# EAGLE design WattMeter (EAGLE 6.3)
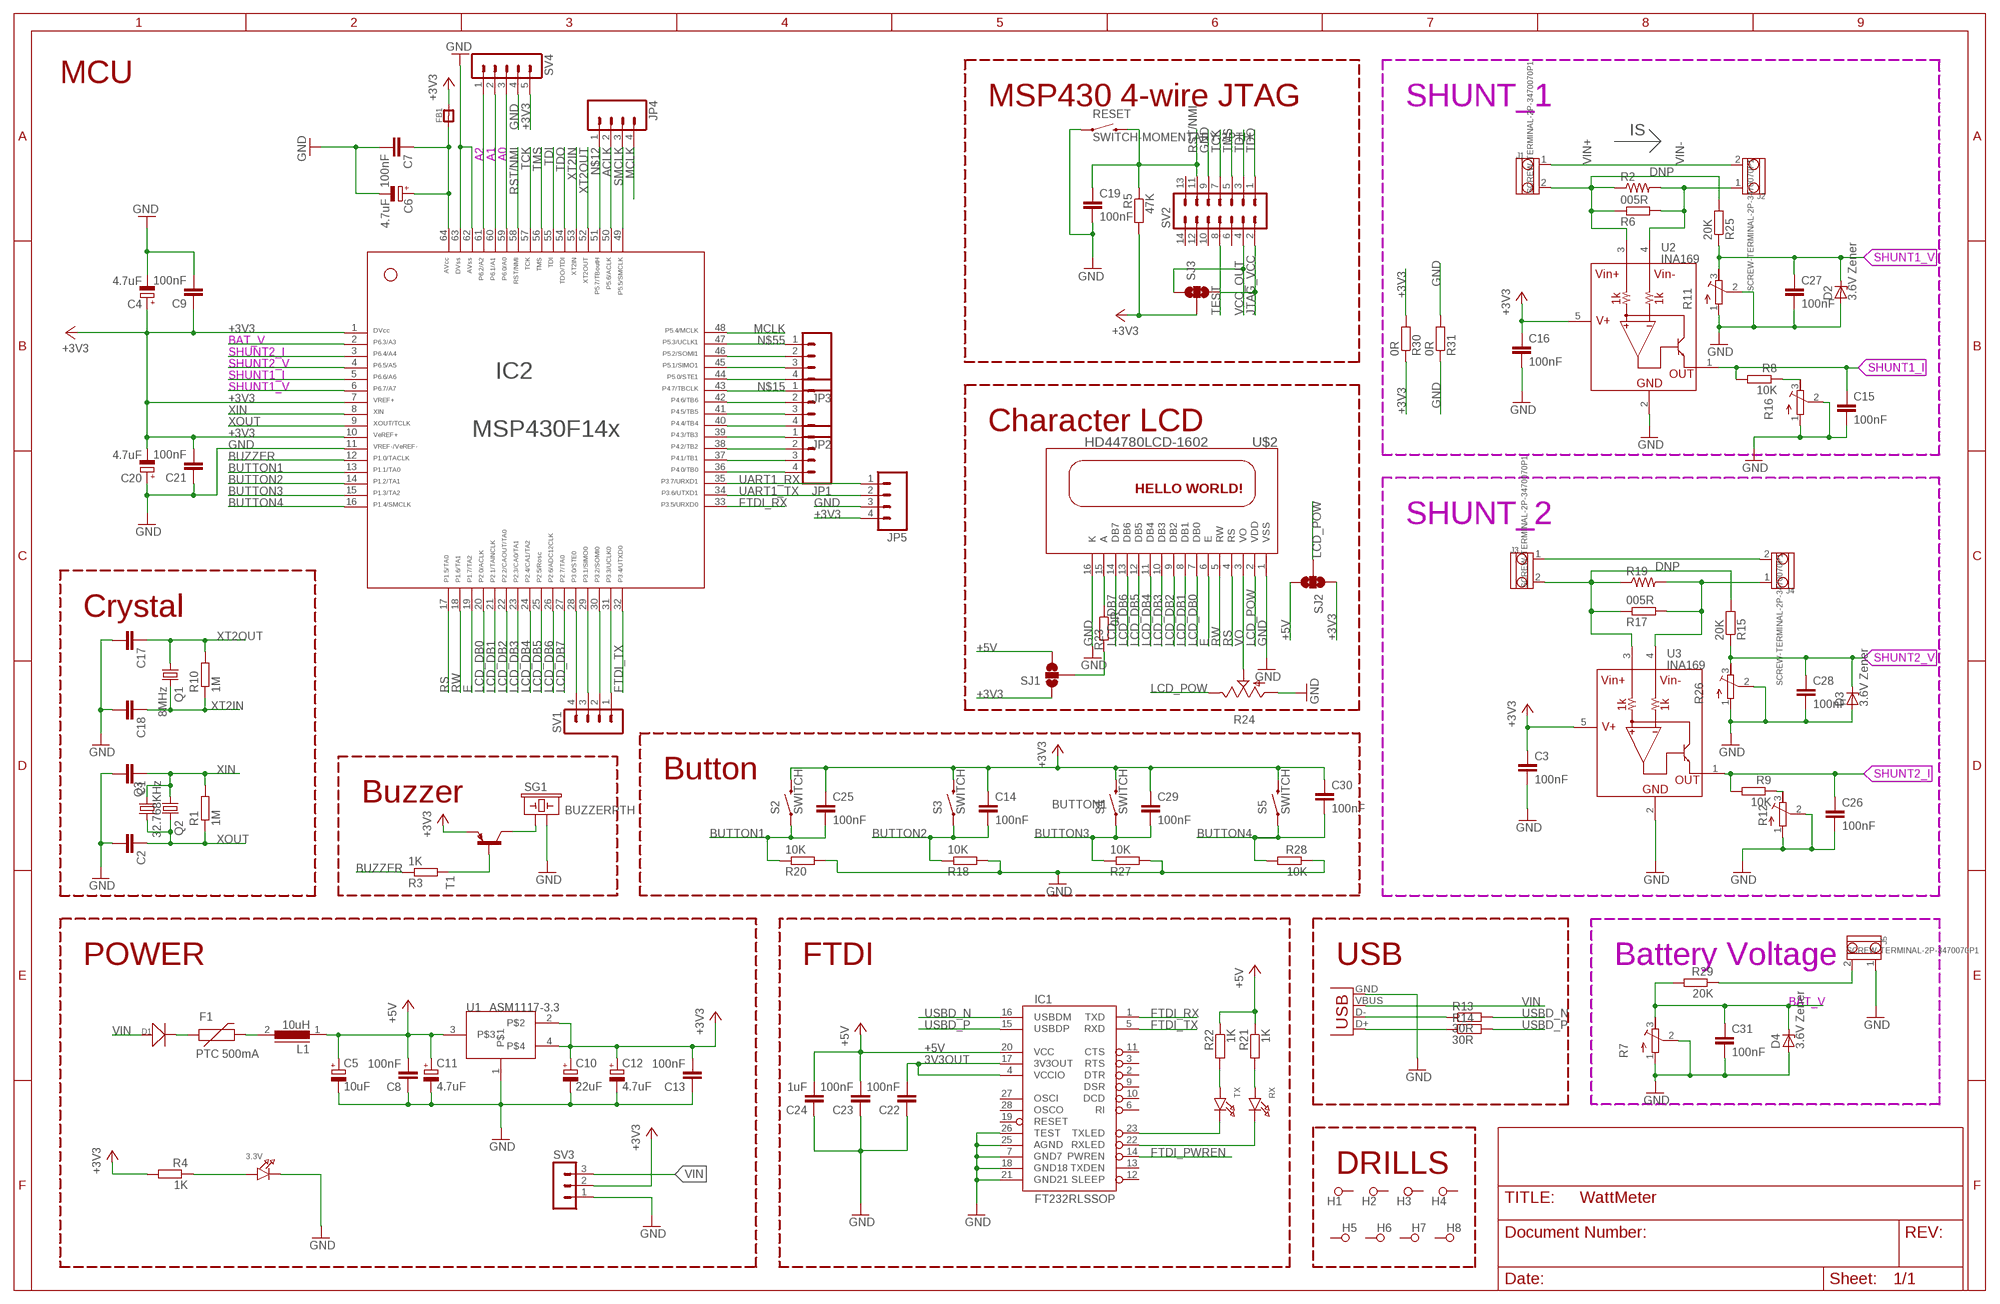
[diagram p0: schematic, sheet 1]

## Parts
3.3V  LED0805  [CHIPLED_0805]
C1  C-EUC0805  [C0805]
C2  C-EUC0805  [C0805]
C3  100nF  C-EUC0805  [C0805]
C4  4.7uF  CPOL-EUA/3216-18W  [A/3216-18W]
C5  10uF  CPOL-EU150CLZ-0810  [150CLZ-0810]
C6  4.7uF  CPOL-EUA/3216-18W  [A/3216-18W]
C7  100nF  C-EUC0805  [C0805]
C8  100nF  C-EUC0805  [C0805]
C9  100nF  C-EUC0805  [C0805]
C10  22uF  CPOL-EUB/3528-21R  [B/3528-21R]
C11  4.7uF  CPOL-EUA/3216-18W  [A/3216-18W]
C12  4.7uF  CPOL-EUA/3216-18W  [A/3216-18W]
C13  100nF  C-EUC0805  [C0805]
C14  100nF  C-EUC0805  [C0805]
C15  100nF  C-EUC0805  [C0805]
C16  100nF  C-EUC0805  [C0805]
C17  C-EUC0805  [C0805]
C18  C-EUC0805  [C0805]
C19  100nF  C-EUC0805  [C0805]
C20  4.7uF  CPOL-EUA/3216-18W  [A/3216-18W]
C21  100nF  C-EUC0805  [C0805]
C22  100nF  C-EUC0805  [C0805]
C23  100nF  C-EUC0805  [C0805]
C24  1uF  C-EUC0805  [C0805]
C25  100nF  C-EUC0805  [C0805]
C26  100nF  C-EUC0805  [C0805]
C27  100nF  C-EUC0805  [C0805]
C28  100nF  C-EUC0805  [C0805]
C29  100nF  C-EUC0805  [C0805]
C30  100nF  C-EUC0805  [C0805]
C31  100nF  C-EUC0805  [C0805]
D1  D-D1206  [LL-34]
D2  3.6V Zener  ZENER-DIODESMB  [SMB]
D3  3.6V Zener  ZENER-DIODESMB  [SMB]
D4  3.6V Zener  ZENER-DIODESMB  [SMB]
F1  PTC 500mA  PTCSMD  [PTC-1206]
FB1  FERRITE0805  [0805]
H1  SPECIAL_DRILL_0.1000  [PAD_0.1000]
H2  SPECIAL_DRILL_0.1000  [PAD_0.1000]
H3  SPECIAL_DRILL_0.1000  [PAD_0.1000]
H4  SPECIAL_DRILL_0.1000  [PAD_0.1000]
H5  SPECIAL_DRILL_0.1000  [PAD_0.1000]
H6  SPECIAL_DRILL_0.1000  [PAD_0.1000]
H7  SPECIAL_DRILL_0.1000  [PAD_0.1000]
H8  SPECIAL_DRILL_0.1000  [PAD_0.1000]
IC1  FT232RLSSOP  [SSOP28DB]
IC2  F14X---PM/PAG64  [PM/PAG64]
J1  SCREW-TERMINAL-2P-3470070P1  [2P-3.5]
J2  SCREW-TERMINAL-2P-3470070P1  [2P-3.5]
J3  SCREW-TERMINAL-2P-3470070P1  [2P-3.5]
J4  SCREW-TERMINAL-2P-3470070P1  [2P-3.5]
J5  SCREW-TERMINAL-2P-3470070P1  [2P-3.5]
JP1  M041.27MM  [1X04-1.27MM]
JP2  M041.27MM  [1X04-1.27MM]
JP3  M041.27MM  [1X04-1.27MM]
JP4  M041.27MM  [1X04-1.27MM]
JP5  M041.27MM  [1X04-1.27MM]
L1  10uH  DR74  [DR74]
Q1  8MHz  CRYSTALHC49U-V  [HC49U-V]
Q2  32.768KHz  CRYSTALHC49U-V  [HC49U-V]
Q3  CRYSTALTC38H  [TC38H]
R1  1M  R-EU_R0805  [R0805]
R2  RESISTORPTH-2W  [AXIAL-0.8]
R3  1K  R-EU_R0805  [R0805]
R4  1K  R-EU_R0805  [R0805]
R5  47K  R-EU_R0805  [R0805]
R6  005R  R-EU_R2512  [R2512]
R7  R-TRIMM3296W  [RTRIM3296W]
R8  10K  R-EU_R0805  [R0805]
R9  10K  R-EU_R0805  [R0805]
R10  1M  R-EU_R0805  [R0805]
R11  R-TRIMM3296W  [RTRIM3296W]
R12  R-TRIMM3296W  [RTRIM3296W]
R13  30R  R-EU_R0805  [R0805]
R14  30R  R-EU_R0805  [R0805]
R15  20K  R-EU_R0805  [R0805]
R16  R-TRIMM3296W  [RTRIM3296W]
R17  005R  R-EU_R2512  [R2512]
R18  10K  R-EU_R0805  [R0805]
R19  RESISTORPTH-2W  [AXIAL-0.8]
R20  10K  R-EU_R0805  [R0805]
R21  1K  R-EU_R0805  [R0805]
R22  1K  R-EU_R0805  [R0805]
R23  0R  R-EU_R0805  [R0805]
R24  TRIM_US-3223G  [3223G]
R25  20K  R-EU_R0805  [R0805]
R26  R-TRIMM3296W  [RTRIM3296W]
R27  10K  R-EU_R0805  [R0805]
R28  10K  R-EU_R0805  [R0805]
R29  20K  R-EU_R0805  [R0805]
R30  0R  R-EU_R1206  [R1206]
R31  0R  R-EU_R1206  [R1206]
RESET  SWITCH-MOMENTARY-2PTH  [TACTILE-PTH]
RX  LED0805  [CHIPLED_0805]
S2  SWITCH  SWITCH-MOMENTARY-2PTH  [TACTILE-PTH]
S3  SWITCH  SWITCH-MOMENTARY-2PTH  [TACTILE-PTH]
S4  SWITCH  SWITCH-MOMENTARY-2PTH  [TACTILE-PTH]
S5  SWITCH  SWITCH-MOMENTARY-2PTH  [TACTILE-PTH]
SG1  BUZZERPTH  [BUZZER-12MM]
SJ1  SOLDERJUMPER_2WAYS  [SJ_3]
SJ2  SOLDERJUMPER_2WAYS  [SJ_3]
SJ3  SOLDERJUMPER_2WAYS  [SJ_3]
SV1  MA04-1  [MA04-1]
SV2  ML14L  [ML14L]
SV3  MA03-1  [MA03-1]
SV4  MA05-1  [MA05-1]
T1  MMBT3906LT1-PNP-SOT23-BEC  [SOT23-BEC]
TX  LED0805  [CHIPLED_0805]
U1  ASM1117-3.3  [SOT223]
U2  INA169  [SOT23-5]
U3  INA169  [SOT23-5]
U$2  HD44780LCD-1602  [LCD1602]
X2  USBPTH  [USB-B-PTH]

## Nets
3V3OUT: C22.2 IC1.4(VCCIO) IC1.17(3V3OUT)
+3V3: C3.1 C4.+ C9.1 C10.+ C12.+ C13.2 C14.1 C16.1 C20.- C21.2 C25.1 C29.1 C30.1 FB1.1 IC2.1 IC2.7 IC2.10 JP5.4 R4.2 R5.2 R30.1 R30.2 S2.3 S3.3 S4.3 S5.3 SJ1.1 SJ2.1 SJ3.2 SV3.2 SV4.5 T1.E U1.2 U1.4 U2.5(V+) U3.5(V+)
+5V: C5.+ C8.2 C11.+ C23.2 C24.2 IC1.20(VCC) L1.1 R21.1 R22.1 SJ1.3 SJ2.3 U1.3
A0: IC2.59 SV4.3
A1: IC2.60 SV4.2
A2: IC2.61 SV4.1
ACLK: IC2.50 JP4.2
BAT_V: C31.1 D4.C IC2.2 R7.3(E) R29.2
BUTTON1: C25.2 IC2.13 R20.1 S2.1
BUTTON2: C14.2 IC2.14 R18.1 S3.1
BUTTON3: C29.2 IC2.15 R27.1 S4.1
BUTTON4: C30.2 IC2.16 R28.2 S5.1
BUZZER: IC2.12 R3.1
E: IC2.19 U$2.6(E)
FTDI_PWREN: IC1.14(PWREN)
FTDI_RX: IC1.1(TXD) IC2.33
FTDI_TX: IC1.5(RXD) IC2.32
GND: 3.3V.C C1.2 C2.2 C3.2 C4.- C5.- C6.- C7.2 C8.1 C9.2 C10.- C11.- C12.- C13.1 C15.2 C16.2 C17.2 C18.2 C19.2 C20.+ C21.1 C22.1 C23.1 C24.1 C26.2 C27.2 C28.2 C31.2 D2.A D3.A D4.A IC1.7(GND7) IC1.18(GND18) IC1.21(GND21) IC1.25(AGND) IC1.26(TEST) IC2.11 IC2.62 IC2.63 J5.1 JP5.3 R7.1(A) R7.2(S) R11.1(A) R11.2(S) R12.1(A) R12.2(S) R16.1(A) R16.2(S) R18.2 R20.2 R24.1(A) R26.1(A) R26.2(S) R27.2 R28.1 R31.1 R31.2 RESET.1 SG1.- SV2.9 SV3.1 SV4.4 U1.1 U2.2(GND) U3.2(GND) U$2.1(VSS) U$2.16(K) X2.GND
JTAG_VCC: SJ3.3 SV2.2
LCD_DB0: IC2.20 U$2.7(DB0)
LCD_DB1: IC2.21 U$2.8(DB1)
LCD_DB2: IC2.22 U$2.9(DB2)
LCD_DB3: IC2.23 U$2.10(DB3)
LCD_DB4: IC2.24 U$2.11(DB4)
LCD_DB5: IC2.25 U$2.12(DB5)
LCD_DB6: IC2.26 U$2.13(DB6)
LCD_DB7: IC2.27 U$2.14(DB7)
LCD_POW: R24.3(E) SJ2.2 U$2.2(VDD)
MCLK: IC2.48 JP4.4
N$1: SG1.+ T1.C
N$2: D1.C(-) F1.1
N$3: C6.+ C7.1 FB1.2 IC2.64
N$4: IC2.29 SV1.3
N$5: F1.2 L1.2
N$6: IC2.38 JP1.2
N$7: 3.3V.A R4.1
N$8: IC2.37 JP1.3
N$9: IC2.28 SV1.4
N$10: R8.1 R16.3(E)
N$11: J1.1 J2.2
N$12: IC2.51 JP4.1
N$13: J5.2 R29.1
N$14: R3.2 T1.B
N$15: IC2.43 JP2.1
N$16: IC2.36 JP1.4
N$17: R9.1 R12.3(E)
N$18: J3.1 J4.2
N$19: R23.2 SJ1.2
N$21: R23.1 U$2.15(A)
N$30: R22.2 TX.A
N$34: IC1.23(TXLED) TX.C
N$38: R21.2 RX.A
N$39: IC2.46 JP3.2
N$41: IC2.44 JP3.4
N$42: IC1.22(RXLED) RX.C
N$43: IC2.42 JP2.2
N$44: IC2.40 JP2.4
N$51: IC2.39 JP1.1
N$52: IC2.41 JP2.3
N$54: IC2.45 JP3.3
N$55: IC2.47 JP3.1
N$56: IC2.30 SV1.2
N$57: IC2.31 SV1.1
N$60_N: R13.1 X2.D-
N$60_P: R14.1 X2.D+
N$62: J4.1 R17.2 R19.P$2 U3.4(VIN-)
N$63: J3.2 R15.2 R17.1 R19.P$1 U3.3(VIN+)
RS: IC2.17 U$2.4(RS)
RST/NMI: C19.1 IC2.58 R5.1 RESET.3 SV2.11
RW: IC2.18 U$2.5(RW)
SHUNT1_I: C15.1 IC2.5 R8.2 U2.1(OUT)
SHUNT1_V: C27.1 D2.C IC2.6 R11.3(E) R25.1
SHUNT2_I: C26.1 IC2.3 R9.2 U3.1(OUT)
SHUNT2_V: C28.1 D3.C IC2.4 R15.1 R26.3(E)
SMCLK: IC2.49 JP4.3
TCK: IC2.57 SV2.7
TDI: IC2.55 SV2.3
TDO: IC2.54 SV2.1
TEST: SV2.8
TMS: IC2.56 SV2.5
UART1_RX: IC2.35 JP5.1
UART1_TX: IC2.34 JP5.2
USBD_N: IC1.16(USBDM) R13.2
USBD_P: IC1.15(USBDP) R14.2
VCC_OUT: SJ3.1 SV2.4
VIN: D1.A(+) SV3.3 X2.VBUS
VIN+: J1.2 R2.P$1 R6.1 R25.2 U2.3(VIN+)
VIN-: J2.1 R2.P$2 R6.2 U2.4(VIN-)
VO: R24.2(S) U$2.3(VO)
XIN: C1.1 IC2.8 Q2.1 Q3.2 R1.2
XOUT: C2.1 IC2.9 Q2.2 Q3.1 R1.1
XT2IN: C18.1 IC2.53 Q1.2 R10.1
XT2OUT: C17.1 IC2.52 Q1.1 R10.2
Unconnected: H1.1 H2.1 H3.1 H4.1 H5.1 H6.1 H7.1 H8.1 IC1.2(DTR) IC1.3(RTS) IC1.6(RI) IC1.9(DSR) IC1.10(DCD) IC1.11(CTS) IC1.12(SLEEP) IC1.13(TXDEN) IC1.19(RESET) IC1.27(OSCI) IC1.28(OSCO) SV2.6 SV2.10 SV2.12 SV2.13 SV2.14

## Notes on the sheet
- MCU
- MSP430 4-wire JTAG | SHUNT_1
- IS
- Character LCD
- SHUNT_2
- Crystal
- Button
- Buzzer
- POWER | FTDI | USB | Battery Voltage
- DRILLS

## Library data of the parts
3.3V RX TX = microbuilder:LED: LED 0603 - 0603 Surface Mount Package 2mA: Green LED - Low Power (3.9mcd, 2ma, 1.7Vf) - Digikey: 475-2709-2-ND Orange LED - Low Power (9.8mcd, 2ma, 1.8Vf) - Digikey: 475-1194-2-ND Red LED - Low Power (5mcd, 2ma, 1.8Vf) - Digikey: 475-1195-2-ND Yellow LED - Low Power (7mcd, 2ma, 1.8Vf) - Digikey: 475-1196-2-ND 5mA: Blue LED - Low Power (17mcd, 5ma, 2.9Vf) - Digikey: LNJ937W8CRACT-ND 0805 - 0805 Surface Mount Package 2mA: Red LED (8.8mcd, 2mA, 1.8Vf, Clear) - Low Power [Digikey: 475-2510-1-ND] Green LED (5mcd, 2mA, 1.8Vf, Clear) - Low Power [Digikey: 475-2730-1-ND] Yellow LED (11.3mcd, 2mA, 1.8Vf, Clear) - Low Power [Digikey: 475-2555-1-ND] 20mA: Red LED (104mcd, 20mA, Diffused) - LS R976 [Digikey: 475-1278-6-ND] Red LED (12mcd, 20mA, 2.0Vf, Clear) - APT2012EC [Digikey: 754-1128-1-ND] Green LED (15mcd, 20mA, 2.2Vf, Clear) - APT2012GC [Digikey: 754-1131-1-ND] Orange LED (160mcd, 20mA, 2.1Vf, Clear) - APT2012SECK [Digikey: 754-1130-1-ND] 1206 - 1206 Surface Mount Package Green LED (26mcd, 20mA, Diffused) - LG N971 [Digikey: 475-1407-6-ND] Red LED (15mcd, 20mA, Diffused) - LH N974 [Digikey: 475-1416-6-ND]
C1-C3 C7-C9 C13-C19 C21-C31 = resistor:C-EU: CAPACITOR, European symbol
C4-C6 C10-C12 C20 = rcl:CPOL-EU: POLARIZED CAPACITOR, European symbol
D1 = OPL Eagle Library:D*: DIODE
D2-D4 = diode:ZENER-DIODE: Z-Diode
F1 = SparkFun:PTC: Resettable Fuse PTC Resettable Fuse. Spark Fun Electronics SKU : COM-08357
FB1 = microbuilder:FERRITE: Ferrite Bead 0603 MMZ1608B121C - 120 Ohm @ 100MHz, 600mA, 0.15 Ohm DC Resistance - Digikey: 445-2164-1-ND BK1608HW121-T - 120 Ohm, 600mA Ferrite Chip - Digikey: 587-1876-2-ND 0805 HZ0805B272R-10 - 2.7K Ohm @ 100MHz, 200mA, 0.8 Ohm DC Resistance - Digikey: 240-2504-1-ND (see also Murata BLM21BD272SN1L) MMZ2012Y152B - 1.5K Ohm @ 100MHz, 500mA, 0.4 Ohm DC Resistance - Digikey: 445-1560-1-ND - Mainly for high frequency (80-400MHz) MMZ2012R102A - 1K Ohm @ 100MHz, 500mA, 0.3 Ohm DC Resistance - Digikey: 445-1555-2-ND - More general purpose (10-200MHz)
H1-H8 = special-drill:SPECIAL_DRILL_: Special drills
IC1 = SparkFun:FT232RL: USB UART FT232RL 4th Generation USB UART (USB <-> Serial) Controller. Spark Fun Electronics SKU : COM-00650
IC2 = TI_MSP430_v16:F14X---PM/PAG64: *** MSP430F14x *** PM/PAG64
J1-J5 = OPL Eagle Library:SCREW-TERMINAL-2P
JP1-JP5 = SparkFun:M04: Header 4 Standard 4-pin 0.1" header. Use with straight break away headers (SKU : PRT-00116), right angle break away headers (PRT-00553), swiss pins (PRT-00743), machine pins (PRT-00117), and female headers (PRT-00115). Molex polarized connector foot print use with SKU : PRT-08231 with associated crimp pins and housings. 1MM SMD Version SKU: PRT-10208
L1 = inductors:DR74: High Power Density, High Efficiency, Shielded Inductors Source: coiltronics_dr_series.pdf
Q1 Q2 = crystal:CRYSTAL: CRYSTAL; OC_FARNELL: 1666969; OC_NEWARK: unknown
Q3 = crystal:CRYSTAL: CRYSTAL; OC_FARNELL: unknown; OC_NEWARK: unknown
R1 R3-R6 R8-R10 R13-R15 R17 R18 R20-R23 R25 R27-R31 = resistor:R-EU_: RESISTOR, European symbol
R2 R19 = SparkFun-Resistors:RESISTOR: Resistor Basic schematic elements and footprints for 0603, 1206, and PTH resistors.; PLACE: DNP
R7 R11 R12 R16 R26 = rcl:R-TRIMM: Trimm resistor
R24 = pot:TRIM_US-: POTENTIOMETER
RESET S2-S5 = SparkFun:SWITCH-MOMENTARY-2
SG1 = SparkFun:BUZZER: Buzzer 12mm Spark Fun Electronics SKU : Comp-Buzzer
SJ1-SJ3 = SparkFun:SOLDERJUMPER_2WAY: Solder Jumper 2 way solder jumper
SV1 = con-lstb:MA04-1: PIN HEADER; OC_FARNELL: unknown; OC_NEWARK: unknown
SV2 = con-harting-ml:ML14: HARTING; OC_FARNELL: unknown; OC_NEWARK: unknown
SV3 = con-lstb:MA03-1: PIN HEADER; OC_FARNELL: unknown; OC_NEWARK: unknown
SV4 = con-lstb:MA05-1: PIN HEADER; OC_FARNELL: unknown; OC_NEWARK: unknown
T1 = transistor:*-PNP-: PNP Transistror
U1 = Itead_IC_110429:ASM1117-3.3: ICP006
U2 U3 = SparkFun-AnalogIC:INA169
U$2 = BaseApp:HD44780LCD
X2 = SparkFun:USB: USB Connectors USB-B-PTH is fully proven SKU : PRT-00139 USB-miniB is fully proven SKU : PRT-00587 USB-A-PCB is untested. USB-A-H is throughly reviewed, but untested. Spark Fun Electronics SKU : PRT-00437 USB-B-SMT is throughly reviewed, but untested. Needs silkscreen touching up. USB-A-S has not been used/tested USB-MB-H has not been used/tested

## Net classes
0 default: width 0.178 mm, drill 0.381 mm, clearance 0.178 mm
1 power: width 0.254 mm, drill 0.305 mm, clearance 0.152 mm

## Board
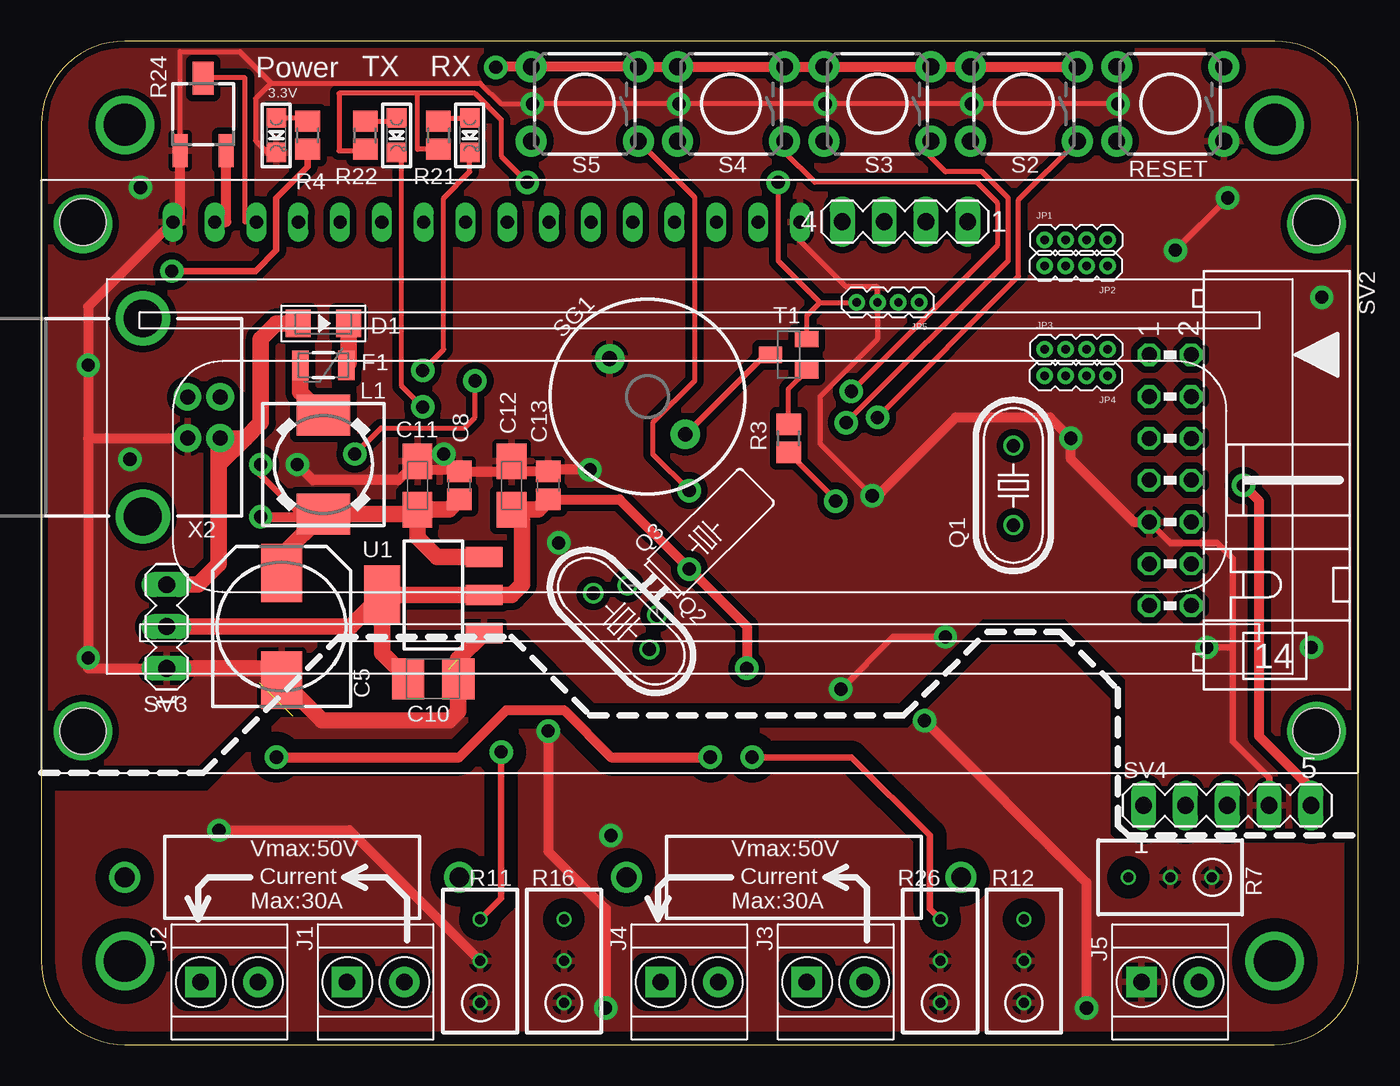
[diagram p1: board, top side]
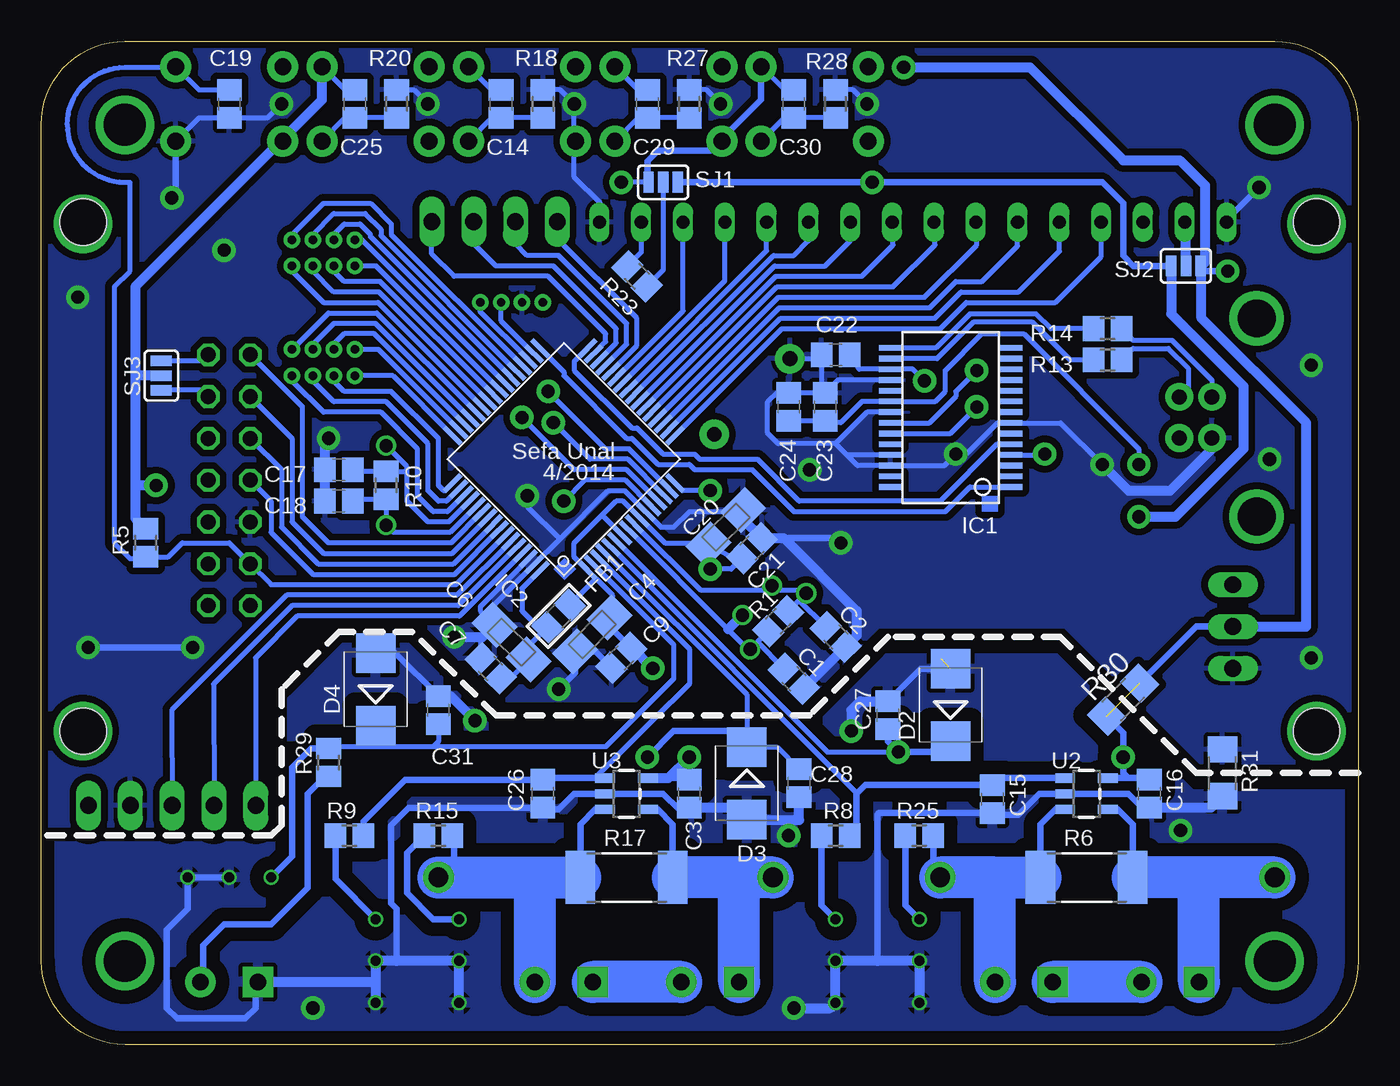
[diagram p2: board, bottom side, seen from below]

Size 80.01 x 60.96 mm. Coordinates in mm from the lower left corner, seen from the top.
Outline: 79.99,5.08 80.01,55.88 arc90 74.93,60.96 5.08,60.96 arc90 0,55.88 0,5.08 arc90 5.08,0 74.91,0 arc90 79.99,5.08
Copper layers (1*2*15*16): Top 0.035mm / dielectric 0.2mm / Route2 0.0175mm / dielectric 1.1mm / Route15 0.0175mm / dielectric 0.2mm / Bottom 0.035mm
Design rules "SeeedStudio_DRU_no_angle_20130527": minimum track width 6mil, minimum drill 12mil, track to track 6mil, track to pad 6mil, pad to pad 6mil, via to via 6mil, smd to smd 0mil, copper to edge 10mil, drill to drill 10mil, minimum pad ring 6mil, minimum via ring 6mil, stop-mask expansion 2mil, vias tented up to drill 25mil, thermal gap 10mil

### Footprints (pad centres in the part's own frame; a part is rotated, then mirrored left to right if it is on the bottom)
CHIPLED_0805 = smd 1.2 x 1.2: A 0,-1.05; C 0,1.05
C0805 = smd 1.3 x 1.5: 1 -0.85,0; 2 0.85,0
A/3216-18W = smd 2.15 x 1.8: + 1.475,0; - -1.475,0
150CLZ-0810 = smd 3.5 x 2.5: + 3.25,0; - -3.25,0
B/3528-21R = smd 1.95 x 2.5: + 1.525,0; - -1.525,0
LL-34 = smd 1.524 x 1.676: A -1.524,0; C 1.524,0
SMB = smd 2.4 x 2.4: A 2.2,0; C -2.2,0
PTC-1206 = smd 1 x 1.8: 1 -1.4,0; 2 1.4,0
0805 = smd 1.3 x 1.5: 1 -0.95,0; 2 0.95,0
PAD_0.1000 = drill 2.54 pad 2.54: 1 0,0
SSOP28DB = smd 0.348 x 1.397: 1 -4.225,-3.656; 2 -3.575,-3.656; 3 -2.925,-3.656; 4 -2.275,-3.656; 5 -1.625,-3.656; 6 -0.975,-3.656; 7 -0.325,-3.656; 8 0.325,-3.656; 9 0.975,-3.656; 10 1.625,-3.656; 11 2.275,-3.656; 12 2.925,-3.656; 13 3.575,-3.656; 14 4.225,-3.656; 15 4.225,3.656; 16 3.575,3.656; 17 2.925,3.656; 18 2.275,3.656; 19 1.625,3.656; 20 0.975,3.656; 21 0.325,3.656; 22 -0.325,3.656; 23 -0.975,3.656; 24 -1.625,3.656; 25 -2.275,3.656; 26 -2.925,3.656; 27 -3.575,3.656; 28 -4.225,3.656
PM/PAG64 = smd 1.4 x 0.3: 1 -5.8,3.75; 2 -5.8,3.25; 3 -5.8,2.75; 4 -5.8,2.25; 5 -5.8,1.75; 6 -5.8,1.25; 7 -5.8,0.75; 8 -5.8,0.25; 9 -5.8,-0.25; 10 -5.8,-0.75; 11 -5.8,-1.25; 12 -5.8,-1.75; 13 -5.8,-2.25; 14 -5.8,-2.75; 15 -5.8,-3.25; 16 -5.8,-3.75; 33 5.8,-3.75; 34 5.8,-3.25; 35 5.8,-2.75; 36 5.8,-2.25; 37 5.8,-1.75; 38 5.8,-1.25; 39 5.8,-0.75; 40 5.8,-0.25; 41 5.8,0.25; 42 5.8,0.75; 43 5.8,1.25; 44 5.8,1.75; 45 5.8,2.25; 46 5.8,2.75; 47 5.8,3.25; 48 5.8,3.75 | smd 0.3 x 1.4: 17 -3.75,-5.8; 18 -3.25,-5.8; 19 -2.75,-5.8; 20 -2.25,-5.8; 21 -1.75,-5.8; 22 -1.25,-5.8; 23 -0.75,-5.8; 24 -0.25,-5.8; 25 0.25,-5.8; 26 0.75,-5.8; 27 1.25,-5.8; 28 1.75,-5.8; 29 2.25,-5.8; 30 2.75,-5.8; 31 3.25,-5.8; 32 3.75,-5.8; 49 3.75,5.8; 50 3.25,5.8; 51 2.75,5.8; 52 2.25,5.8; 53 1.75,5.8; 54 1.25,5.8; 55 0.75,5.8; 56 0.25,5.8; 57 -0.25,5.8; 58 -0.75,5.8; 59 -1.25,5.8; 60 -1.75,5.8; 61 -2.25,5.8; 62 -2.75,5.8; 63 -3.25,5.8; 64 -3.75,5.8
2P-3.5 = drill 1 pad 1.85 square: 1 -1.75,0 | drill 1 pad 1.85: 2 1.75,0
1X04-1.27MM = drill 0.508 pad 1: 1 0,0; 2 1.27,0; 3 2.54,0; 4 3.81,0
DR74 = smd 2.5 x 3.25: 1 -3,0; 2 3,0
HC49U-V = drill 0.813: 1 -2.413,0; 2 2.413,0
TC38H = drill 0.813: 1 -1.27,0; 2 1.27,0
R0805 = smd 1.3 x 1.5: 1 -0.85,0; 2 0.85,0
AXIAL-0.8 = drill 1.2 pad 1.88: P$1 -10.16,0; P$2 10.16,0
R2512 = smd 1.8 x 3.2: 1 -2.8,0; 2 2.8,0
RTRIM3296W = drill 0.61: 1 0,-2.54; 2 0,0; 3 0,2.54
3223G = smd 2 x 0.9: 1 -2.2,1.4; 3 -2.2,-1.4 | smd 2 x 1.3: 2 2.2,0
R1206 = smd 1.6 x 1.803: 1 -1.422,0; 2 1.422,0
TACTILE-PTH = drill 1.016 pad 1.88: 1 -3.251,2.261; 2 3.251,2.261; 3 -3.251,-2.261; 4 3.251,-2.261
BUZZER-12MM = drill 0.9 pad 1.778: + 3.25,0; - -3.25,0
SJ_3 = smd 0.635 x 1.27: 1 -0.889,0; 2 0,0; 3 0.889,0
MA04-1 = drill 1.016 long: 1 -3.81,0; 2 -1.27,0; 3 1.27,0; 4 3.81,0
ML14L = drill 0.914 octagon: 1 -7.62,-1.27; 2 -7.62,1.27; 3 -5.08,-1.27; 4 -5.08,1.27; 5 -2.54,-1.27; 6 -2.54,1.27; 7 0,-1.27; 8 0,1.27; 9 2.54,-1.27; 10 2.54,1.27; 11 5.08,-1.27; 12 5.08,1.27; 13 7.62,-1.27; 14 7.62,1.27
MA03-1 = drill 1.016 long: 1 -2.54,0; 2 0,0; 3 2.54,0
MA05-1 = drill 1.016 long: 1 -5.08,0; 2 -2.54,0; 3 0,0; 4 2.54,0; 5 5.08,0
SOT23-BEC = smd 1 x 1.4: B -0.95,-1.1; C 0,1.1; E 0.95,-1.1
SOT223 = smd 1.219 x 2.235: 1 -2.311,-3.099; 2 0,-3.099; 3 2.311,-3.099 | smd 3.6 x 2.2: 4 0,3.099
SOT23-5 = smd 0.55 x 1.2: 1 -0.95,-1.3; 2 0,-1.3; 3 0.95,-1.3; 4 0.95,1.3; 5 -0.95,1.3
LCD1602 = drill 0.8 long: 1 8,33.46; 2 10.54,33.46; 3 13.08,33.46; 4 15.62,33.46; 5 18.16,33.46; 6 20.7,33.46; 7 23.24,33.46; 8 25.78,33.46; 9 28.32,33.46; 10 30.86,33.46; 11 33.4,33.46; 12 35.94,33.46; 13 38.48,33.46; 14 41.02,33.46; 15 43.56,33.46; 16 46.1,33.46 | hole 2.8: 2.54,2.54; 2.54,33.46; 77.46,33.46; 77.46,2.54
USB-B-PTH = drill 0.914 pad 1.676: D+ 0,1.25; D- 1.981,1.25; GND 0,-1.25; VBUS 1.981,-1.25 | drill 2.286: S1 -2.718,-6.02; S2 -2.718,6.02

### Placement (x,y rotation side)
3.3V  14.29,55.24 180 top
C1  34.29,22.23 315 bottom
C2  31.75,24.77 315 bottom
C3  40.64,15.24 270 bottom
C4  46.53,24.92 45 bottom
C5  14.61,25.4 90 top
C6  51.44,24.45 315 bottom
C7  52.7,22.86 135 bottom
C8  25.4,33.97 270 top
C9  44.77,23.5 225 bottom
C10  23.81,22.23 180 top
C11  22.86,33.97 270 top
C12  28.57,33.97 270 top
C13  30.8,33.97 270 top
C14  52.07,57.15 270 bottom
C15  22.23,14.92 270 bottom
C16  12.7,15.24 270 bottom
C17  61.91,34.92 180 bottom
C18  61.91,33.02 180 bottom
C19  68.58,57.15 270 bottom
C20  38.42,31.43 45 bottom
C21  36.83,30.16 225 bottom
C22  31.75,41.91 0 bottom
C23  32.38,38.73 270 bottom
C24  34.61,38.73 270 bottom
C25  60.96,57.15 270 bottom
C26  49.53,15.24 270 bottom
C27  28.57,20 90 bottom
C28  33.97,15.88 270 bottom
C29  43.18,57.15 270 bottom
C30  34.29,57.15 270 bottom
C31  55.88,20.32 90 bottom
D1  17.14,43.81 0 top
D2  24.77,20.64 90 bottom
D3  37.15,15.88 270 bottom
D4  59.69,21.59 90 bottom
F1  17.14,41.27 180 top
FB1  48.58,26.04 225 bottom
H1  5.08,55.88 0 top
H2  74.93,55.88 0 top
H3  74.93,5.08 0 top
H4  5.08,5.08 0 top
H5  2.54,19.05 0 top
H6  2.54,49.85 0 top
H7  77.47,49.85 0 top
H8  77.47,19.05 0 top
IC1  24.77,38.1 90 bottom
IC2  48.26,35.56 135 bottom
J1  20.32,3.81 0 top
J2  11.43,3.81 0 top
J3  48.26,3.81 0 top
J4  39.37,3.81 0 top
J5  68.58,3.81 0 top
JP1  60.96,48.9 0 top
JP2  64.77,47.31 180 top
JP3  60.96,42.23 0 top
JP4  64.77,40.64 180 top
JP5  53.34,45.09 180 top
L1  17.14,35.24 90 top
Q1  59.05,33.97 270 top
Q2  35.24,25.72 135 top
Q3  36.51,26.99 315 top
R1  35.24,25.72 225 bottom
R2  15.24,10.16 180 top
R3  45.4,36.83 90 top
R4  16.19,55.24 270 top
R5  73.66,30.48 90 bottom
R6  16.51,10.16 0 bottom
R7  68.58,10.16 90 top
R8  31.75,12.7 0 bottom
R9  61.28,12.7 0 bottom
R10  59.05,33.97 90 bottom
R11  26.67,5.08 0 top
R12  59.69,5.08 0 top
R13  15.24,41.59 180 bottom
R14  15.24,43.5 180 bottom
R15  55.88,12.7 0 bottom
R16  31.75,5.08 0 top
R17  44.45,10.16 0 bottom
R18  49.53,57.15 90 bottom
R19  45.72,10.16 180 top
R20  58.42,57.15 90 bottom
R21  24.13,55.24 90 top
R22  19.68,55.24 90 top
R23  43.81,46.67 315 bottom
R24  9.84,56.52 90 top
R25  26.67,12.7 0 bottom
R26  54.61,5.08 0 top
R27  40.64,57.15 90 bottom
R28  31.75,57.15 270 bottom
R29  62.55,17.14 90 bottom
R30  14.29,20.95 45 bottom
R31  8.26,16.51 90 bottom
RESET  68.58,57.15 180 top
RX  26.04,55.24 180 top
S2  59.69,57.15 180 top
S3  50.8,57.15 180 top
S4  41.91,57.15 180 top
S5  33.02,57.15 180 top
SG1  36.83,39.37 315 top
SJ1  42.23,52.39 0 bottom
SJ2  10.48,47.31 180 bottom
SJ3  72.71,40.64 90 bottom
SV1  52.47,50 180 top
SV2  68.58,34.29 270 top
SV3  7.62,25.4 90 top
SV4  72.05,14.53 0 top
T1  45.4,41.91 90 top
TX  21.59,55.24 180 top
U1  23.81,27.3 90 top
U2  16.51,15.24 270 bottom
U3  44.45,15.24 270 bottom
U$2  0,16.51 0 top
X2  8.89,38.1 0 top

### Tracks (layer width: path | path; a pad name or v marks a point on that pad's centre or on a via)
3V3OUT  (via drill 0.8 pad 1.42)
  Top 0.305: v19.05,35.88 20.64,37.47 25.72,37.47 26.35,38.1 v26.35,40.32
  Bottom 0.305: C22.2 30.33,41.02 IC1.17 27.05,41.02 v26.35,40.32 | IC1.4 19.1,35.83 v19.05,35.88
+3V3  (via drill 0.8 pad 1.42)  (1 unrouted)
  Top 0.305: 27.66,59.41 v27.62,59.37 | v44.77,52.39 44.77,47.62 47.31,45.09 | 47.31,45.09 JP5.4 | T1.E 46.5,44.28 47.31,45.09
  Top 0.406: R4.2 16.19,53.34 14.29,51.44 14.29,48.26 13.02,46.99 v7.94,46.99
  Top 0.61: S2.3 S3.3 S4.3 S5.3 27.66,59.41 | C13.2 35.14,33.12 v39.37,28.89 42.86,25.4 v42.86,22.86 | SV4.5 77.15,15.56 73.98,18.73 73.98,33.02 v73.03,33.97 | v14.29,17.46 25.4,17.46 28.26,20.32 31.75,20.32 34.61,17.46 v40.64,17.46
  Top 1.016: U1.4 U1.2 28.57,27.3 29.21,27.94 29.21,31.86 C12.+ 30.17,32.5 C13.2 | U1.4 18.81,25.4 SV3.2 | C10.+ 20.71,23.8 U1.4
  Bottom 0.305: IC2.7 45.88,32.12 45.88,32.23 | 46.31,28.3 IC2.1 47.62,29.62 47.62,30.48 45.88,32.23 | 46.31,28.3 45.31,27.31 C4.+ | FB1.1 46.31,28.3 | 46.31,28.3 | 45.88,32.23 45.09,33.02 44.66,33.02 IC2.10 42.12,30.48 40.01,30.48 C20.- 38,29.56 C21.2 38.1,28.89 v39.37,28.89 | C30.1 34.86,58 S5.3 | C29.1 43.75,58 S4.3 | S3.3 52.64,58 C14.1 | S2.3 61.53,58 C25.1 | SJ1.1 v44.77,52.39
  Bottom 0.406: C16.1 arc-90 12.8,16.19 U2.5 13.97,16.19 14.29,16.51 v14.29,17.46 14.29,18.94 R30.1 | U3.5 40.74,16.19 C3.1 | SJ1.1 43.18,52.45 43.18,53.66 42.55,54.29 39.37,54.29 36.27,57.39 S5.3 | v7.94,46.99 9.27,46.99 9.53,47.24 | R30.2 9.84,25.4 SV3.2 | C9.1 45.49,25.42 C4.+
  Bottom 0.61: SJ3.2 74.3,40.64 | 74.3,40.64 74.3,46.04 62.94,57.39 S2.3 | 74.3,40.64 74.3,33.97 | 74.3,33.97 74.3,31.96 R5.2 | v27.62,59.37 19.94,59.37 14.29,53.72 10.86,53.72 9.32,52.2 9.34,47.5 SJ2.1 9.53,47.24 9.53,44.13 3.17,37.78 3.17,25.4 SV3.2 | v73.03,33.97 74.3,33.97 | v42.86,22.86 44.13,24.13 44.45,24.13 | U3.5 41.91,16.19 v40.64,17.46
+5V  (via drill 0.8 pad 1.42)
  Top 0.305: v29.53,52.39 27.94,53.98 27.94,56.2 26.35,57.78 22.86,57.78 | 22.86,57.78 18.1,57.78 18.1,54.29 19.68,54.29 R22.1 | R21.1 22.86,54.4 22.86,57.78
  Top 0.406: L1.1 15.7,32.24 13.34,34.61 v13.34,35.24
  Top 0.61: v13.34,32.07 16.68,32.07 17,32.38 L1.1
  Top 1.016: C11.+ 22.61,32.24 L1.1 14.61,29.7 C5.+ | U1.3 24.04,29.62 22.86,30.8 C11.+ | C11.+ 24.77,32.5 C8.2
  Bottom 0.305: C24.2 C23.2 32.28,37.78 31.43,37.78 30.14,39.08 IC1.20 25.7,39.08 25.08,39.69 25.08,40.96 22.86,43.18 20.32,43.18 13.34,36.2 v13.34,35.24
  Bottom 0.406: SJ1.3 v29.53,52.39 15.56,52.39 14.29,51.12 14.29,47.94 13.65,47.31 SJ2.3
  Bottom 0.61: SJ2.3 11.37,44.39 6.99,40.01 6.99,36.2 11.11,32.07 v13.34,32.07
A0
  Bottom 0.305: IC2.59 54.75,27.3 65.09,27.3 72.07,20.32 SV4.3
A1
  Bottom 0.305: IC2.60 54.67,26.67 64.77,26.67 69.53,21.91 SV4.2
A2
  Bottom 0.305: IC2.61 54.6,26.04 64.45,26.04 66.99,23.5 SV4.1
ACLK
  Bottom 0.305: IC2.50 55.4,33.02 55.88,33.02 56.52,33.66 56.52,36.51 59.05,39.05 62.23,39.05 63.5,40.32 JP4.2
BAT_V
  Bottom 0.305: IC2.2 41.59,24.3 41.59,22.23 45.72,18.1 56.2,18.1 | 56.2,18.1 59.69,18.1 | 59.69,18.1 62.45,18.1 R29.2 | D4.C 59.69,18.1 | C31.1 55.88,18.41 56.2,18.1
  Bottom 0.406: R29.2 63.6,18 64.77,16.83 64.77,11.43 R7.3
BUTTON1  (via drill 0.8 pad 1.42)
  Top 0.305: v50.8,38.1 59.37,46.67 59.37,51.32 S2.1
  Bottom 0.305: IC2.13 44.44,34.92 47.62,34.92 v50.8,38.1 | R20.1 C25.2 61.53,56.3 S2.1
BUTTON2  (via drill 0.8 pad 1.42)
  Top 0.305: v48.9,37.78 58.74,47.62 58.74,51.44 57.15,53.02 54.93,53.02 53.98,53.98 53.98,54.81 arc-90 S3.1
  Bottom 0.305: IC2.14 44.37,35.56 46.67,35.56 v48.9,37.78 | R18.1 C14.2 52.64,56.3 S3.1
BUTTON3  (via drill 0.8 pad 1.42)
  Top 0.305: v49.21,39.69 58.1,48.58 58.1,51.12 56.83,52.39 46.99,52.39 45.16,54.22 S4.1
  Bottom 0.305: IC2.15 44.3,36.2 45.72,36.2 v49.21,39.69 | R27.1 C29.2 43.75,56.3 S4.1
BUTTON4  (via drill 0.8 pad 1.42)
  Top 0.305: S5.1 39.69,51.47 39.69,40.32 37.15,37.78 37.15,35.88 v39.37,33.66
  Bottom 0.305: S5.1 34.86,56.3 C30.2 R28.2 | v39.37,33.66 41.05,33.66 IC2.16
BUZZER  (via drill 0.8 pad 1.42)
  Top 0.305: R3.1 48.26,33.12 v48.26,33.02
  Bottom 0.305: IC2.12 44.52,34.29 46.99,34.29 v48.26,33.02
E
  Bottom 0.305: IC2.19 35.16,44.77 26.04,44.77 24.45,46.35 22.86,46.35 20.7,48.52 U$2.6
FTDI_RX
  Bottom 0.305: IC1.1 23.59,33.88 25.08,32.38 34.29,32.38 36.83,34.92 40.32,34.92 40.64,35.24 42.55,35.24 44.13,36.83 44.45,36.83 48.26,40.64 48.26,40.86 IC2.33
FTDI_TX
  Bottom 0.305: IC1.5 21.95,36.48 25.4,33.02 33.97,33.02 36.51,35.56 40.01,35.56 40.32,35.88 42.23,35.88 43.81,37.47 44.13,37.47 47.62,40.96 47.62,41.5 IC2.32
GND  (via drill 0.8 pad 1.42)  (1 unrouted)
  Top 0.305: v65.41,57.15 v56.52,57.15 v47.62,57.15 v38.73,57.15 v29.84,57.15 27.94,57.15 26.67,58.42 13.97,58.42 | 13.97,58.42 13.02,57.47 13.02,54.93 13.75,54.2 3.3V.C | R24.1 8.44,60.33 12.06,60.33 13.97,58.42 | 24.77,35.45 C8.1 25.4,34.92 v24.45,35.88 | 27.95,34.82 C12.- 28.42,35.29 IC1.26 28.77,34.82 | 22.86,35.24 23.18,34.92 | U$2.16 46.04,49.91 46.04,48.9 48.9,46.04 50.8,46.04 JP5.3 50.8,42.86 47.31,39.37 47.31,36.51 v50.48,33.34
  Top 0.406: SV2.9 68.58,30.48 71.44,30.48 72.39,29.53 72.39,24.13 | 72.39,24.13 72.39,18.41 74.61,16.19 SV4.4 | v48.58,21.59 51.75,24.77 v54.93,24.77 | v68.9,48.26 v72.07,51.44 | v2.86,23.5 3.17,23.18 3.17,22.86 | v70.8,24.13 72.39,24.13
  Top 0.61: R24.1 8.44,49.97 U$2.1 2.86,44.83 2.86,36.83 | C8.1 27.95,34.82 | 28.77,34.82 C13.1 30.9,34.92 v33.34,34.92 | v15.56,35.24 16.51,34.29 21.7,34.29 C11.- | 23.18,34.92 25.4,34.92 | v50.48,33.34 50.8,33.34 55.56,38.1 61.28,38.1 v62.55,36.83 62.55,35.56 66.36,31.75 SV2.9 | 2.86,36.83 v2.86,23.5 2.86,22.86 3.17,22.86 SV3.1 | X2.GND 8.87,36.83 2.86,36.83 | v30.8,19.05 30.8,11.75 34.29,8.26 v34.29,2.22 | v10.79,13.02 18.73,13.02 R11.2 | v53.66,19.68 63.5,9.84 v63.5,2.22
  Top 1.016: SV3.1 13.89,22.86 C5.- 17.07,19.68 24.77,19.68 25.34,20.26 C10.- 25.34,23.42 U1.1
  Bottom 0.305: C23.1 C24.1 34.39,39.69 35.24,39.69 35.88,39.05 35.88,37.15 35.24,36.51 31.75,36.51 | IC1.21 29.84,38.42 31.75,36.51 | IC1.25 31.06,35.83 | 31.06,35.83 31.75,36.51 | 31.06,35.83 30.41,35.17 IC1.26 25.15,35.17 v24.45,35.88 23.81,35.88 21.91,37.77 IC1.7 18.09,37.77 v15.56,35.24 | IC1.18 31.59,40.38 C23.1 | C6.- 52.48,26.75 IC2.63 48.5,30.72 | IC2.62 53.34,26.59 53.34,26.35 C6.- | C6.- 53.31,24.66 C7.2 | 48.5,30.72 45.57,33.66 44.59,33.66 IC2.11 42.37,31.43 41.59,31.43 40.64,32.38 38.42,32.38 38.33,32.48 C20.+ 37.38,31.91 | C23.1 32.6,39.8 C22.1 32.68,41.67 SG1.- | R20.2 57.37,58 v56.52,57.15 | R18.2 48.48,58 v47.62,57.15 47.62,52.7 46.04,51.12 46.04,50.03 U$2.16 | v38.73,57.15 39.59,58 R27.2 | RESET.1 70.42,56.3 C19.2 66.25,56.3 v65.41,57.15 | C18.2 C17.2 | v29.84,57.15 30.7,58 R28.1 | v50.48,33.34 50.48,32.7 48.5,30.72
  Bottom 0.406: C16.2 13.12,14.39 13.97,15.24 U2.2 19.37,15.24 20.64,13.97 22.12,13.97 C15.2 29.11,14.07 29.21,13.97 29.21,5.08 | C3.2 40.74,14.29 41.27,14.29 42.23,15.24 U3.2 47.62,15.24 48.58,14.29 49.43,14.29 C26.2 57.68,14.39 58.74,13.34 58.74,8.57 58.42,8.26 58.42,5.08 | 37.12,13.65 D3.A 37.86,14.39 | R7.2 R7.1 71.12,8.26 72.39,6.99 72.39,2.22 71.75,1.59 67.63,1.59 66.99,2.22 66.99,3.65 J5.1 | C7.2 53.59,23.46 | D4.A 58.5,23.79 C31.2 | D2.A 26.59,22.84 C27.2 | C9.2 46.35,23.87 C4.- 47.57,22.59 v48.58,21.59 | v72.07,51.44 71.83,51.68 RESET.1 | v6.03,52.07 8,50.1 U$2.1 | v31.43,30.48 31.72,30.76 35.24,30.76 | v77.15,24.13 v70.8,24.13
  Bottom 0.61: R11.1 R11.2 29.21,5.08 R16.2 R16.1 32.07,2.22 v34.29,2.22 | R26.1 R26.2 58.42,5.08 R12.2 59.69,3.81 | 59.69,3.81 R12.1 | C1.2 C2.2 30.48,24.83 30.48,26.35 34.89,30.76 35.24,30.76 C21.1 37.38,31.91 | v15.56,35.24 13.97,33.66 11.43,33.66 8.89,36.2 X2.GND | C18.2 62.76,36.62 v62.55,36.83 | v54.93,24.77 53.2,24.77 C6.- | C28.2 33.97,13.65 34.61,13.65 | 37.12,13.65 34.61,13.65 | 37.86,14.39 C3.2 | J5.1 59.69,3.81 | v30.8,19.05 30.8,20.32 30.27,20.85 C27.2 | R31.1 8.95,14.39 C16.2 | v34.61,12.7 34.61,13.65 | C31.2 55.14,21.17 v53.66,19.68
  other vias: 5.4,35.56 2.86,41.27 77.79,45.4
  pour Bottom (isolate 0.406): -21.27,73.66 -15.88,16.83 0,17.14 9.53,17.14 17.78,25.4 29.21,25.4 33.66,20.95 52.07,20.95 57.15,26.04 62.23,26.04 66.04,22.23 66.04,13.97 66.67,13.34 86.36,13.34 87.31,13.65 86.36,66.99
  pour Bottom (isolate 0.813): -15.88,13.97 -19.68,-6.99 84.45,-6.99 92.71,1.27 92.71,12.06 65.41,12.06 64.77,12.7 64.77,20.95 61.59,24.13 57.78,24.13 52.7,19.05 33.02,19.05 28.57,23.5 18.41,23.5 10.16,15.24 -10.16,15.24
  pour Top (isolate 0.406): -20.32,72.39 -20.32,22.23 -15.24,17.14 9.53,17.14 17.78,25.4 29.21,25.4 33.66,20.95 52.07,20.95 57.15,26.04 62.23,26.04 66.04,22.23 66.04,13.97 66.67,13.34 93.98,13.34 103.5,22.86 103.5,57.78 82.55,78.74 -13.97,78.74
  pour Top (isolate 0.813): -10.16,11.43 0,15.24 10.16,15.24 14.61,19.68 32.38,19.68 33.02,19.05 52.7,19.05 57.78,24.13 61.59,24.13 64.77,20.95 64.77,12.7 65.41,12.06 80.01,12.06 81.28,10.79 88.9,10.79 93.98,5.71 93.98,-8.89 84.45,-18.41 -22.86,-18.41 -26.67,-14.61 -27.94,5.71 -21.59,12.06
JTAG_VCC
  Bottom 0.305: SV2.2 70.23,41.53 SJ3.3
LCD_DB0
  Bottom 0.305: IC2.20 35.24,45.4 26.35,45.4 23.18,48.58 23.18,49.91 U$2.7
LCD_DB1
  Bottom 0.305: IC2.21 35.31,46.04 28.26,46.04 25.72,48.58 25.72,49.91 U$2.8
LCD_DB2
  Bottom 0.305: IC2.22 35.38,46.67 30.16,46.67 28.26,48.58 28.26,49.91 U$2.9
LCD_DB3
  Bottom 0.305: IC2.23 35.45,47.31 32.38,47.31 30.86,48.83 U$2.10
LCD_DB4
  Bottom 0.305: IC2.24 35.52,47.94 34.29,47.94 33.4,48.83 U$2.11
LCD_DB5
  Bottom 0.305: IC2.25 35.94,48.23 U$2.12
LCD_DB6
  Bottom 0.305: IC2.26 38.48,46.4 U$2.13
LCD_DB7
  Bottom 0.305: IC2.27 41.02,44.57 U$2.14
LCD_POW
  Top 0.61: R24.3 11.24,49.97 U$2.2
  Bottom 0.61: SJ2.2 10.48,49.91 arc-90 U$2.2
MCLK
  Bottom 0.305: IC2.48 58.64,40.64 JP4.4
N$1
  Top 0.406: T1.C 43.65,41.59 SG1.+
N$2
  Top 1.016: D1.C 18.67,41.4 F1.1
N$3
  Bottom 0.305: IC2.64 50.8,27.72 50.8,26.35 49.81,25.36 FB1.2 50.39,24.22 C6.+ 51.54,22.26 C7.1
N$4
  Bottom 0.305: IC2.29 44.45,42.55 44.45,43.81 48.58,47.94 50.48,47.94 51.2,48.66 SV1.3
N$5
  Top 1.016: F1.2 15.74,39.64 L1.2
N$6
  Bottom 0.305: JP1.2 62.23,49.21 61.59,49.85 60.64,49.85 60.01,49.21 60.01,49.08 IC2.38
N$7
  Top 0.305: R4.1 15.36,56.3 3.3V.A
N$8
  Bottom 0.305: JP1.3 63.5,49.21 62.23,50.48 60.33,50.48 59.37,49.53 59.37,49.15 IC2.37
N$9
  Bottom 0.305: IC2.28 43.81,42.48 43.81,44.13 48.66,48.98 SV1.4
N$10
  Bottom 0.406: R8.1 32.6,8.47 R16.3
N$11
  Bottom 2.54: J2.2 J1.1
N$12
  Bottom 0.305: IC2.51 55.32,32.38 56.2,32.38 57.15,33.34 57.15,36.2 59.37,38.42 62.87,38.42 64.77,40.32 JP4.1
N$13
  Bottom 0.406: R29.1 62.76,16.3 63.82,15.24 63.82,9.53 66.04,7.3 68.9,7.3 70.17,6.03 70.17,3.97 J5.2
N$14
  Top 0.305: R3.2 45.4,39.86 T1.B
N$15
  Bottom 0.305: JP2.1 64.77,46.99 62.87,45.09 59.55,45.09 IC2.43
N$16
  Bottom 0.305: JP1.4 64.77,49.21 62.87,51.12 60.01,51.12 58.74,49.85 58.74,49.22 IC2.36
N$17
  Bottom 0.406: R9.1 62.13,10.06 R12.3
N$18
  Bottom 2.54: J4.2 J3.1
N$19
  Bottom 0.305: SJ1.2 42.23,47.06 R23.2
N$21
  Bottom 0.305: U$2.15 43.56,48.13 R23.1
N$30
  Top 0.305: 19.25,56.09 R22.2 20,56.09 21.59,56.09 TX.A
N$34  (via drill 0.8 pad 1.42)
  Top 0.305: v23.18,38.73 21.91,40.01 21.91,53.88 TX.C
  Bottom 0.305: IC1.23 24.79,37.12 v23.18,38.73
N$38
  Top 0.305: R21.2 24.33,56.3 RX.A
N$39
  Bottom 0.305: IC2.46 59.77,43.18 61.59,43.18 62.23,42.55 JP3.2
N$41
  Bottom 0.305: JP3.4 62.55,44.45 59.62,44.45 IC2.44
N$42  (via drill 0.8 pad 1.42)
  Top 0.305: RX.C 26.04,53.02 24.45,51.44 24.45,42.23 v23.18,40.96
  Bottom 0.305: IC1.22 26.04,37.77 24.45,39.37 24.45,39.69 v23.18,40.96
N$43
  Bottom 0.305: IC2.42 59.48,45.72 62.23,45.72 63.5,46.99 JP2.2
N$44
  Bottom 0.305: IC2.40 59.65,47.31 JP2.4
N$51
  Bottom 0.305: IC2.39 60.53,48.9 JP1.1
N$52
  Bottom 0.305: IC2.41 59.41,46.35 61.59,46.35 62.23,46.99 JP2.3
N$54
  Bottom 0.305: IC2.45 59.7,43.81 62.23,43.81 63.5,42.55 JP3.3
N$55
  Bottom 0.305: IC2.47 59.52,42.23 JP3.1
N$56
  Bottom 0.305: IC2.30 45.09,42.62 45.09,43.5 48.9,47.31 52.39,47.31 53.74,48.66 SV1.2
N$57
  Bottom 0.305: IC2.31 45.72,42.7 45.72,43.18 49.21,46.67 54.93,46.67 56.28,48.02 SV1.1
N$60_N
  Bottom 0.305: R13.1 13.69,42.29 11.54,42.29 10.34,41.09 10.34,39.88 X2.D-
N$60_P
  Bottom 0.305: R14.1 13.69,42.8 11.32,42.8 8.89,40.36 X2.D+
N$62
  Bottom 0.406: U3.4 42.55,14.29 41.65,13.39 R17.2
  Bottom 2.54: J4.1 37.62,10.16 R19.P$2 R17.2
N$63
  Bottom 0.406: R15.2 54.93,12.6 54.93,10.16 | U3.3 46.35,14.29 47.25,13.39 R17.1
  Bottom 2.54: R19.P$1 54.93,10.16 50.01,10.16 | 50.01,10.16 R17.1 | J3.2 50.01,10.16
RS
  Bottom 0.305: IC2.17 35.02,43.5 25.4,43.5 23.81,45.09 18.41,45.09 15.62,47.88 U$2.4
RST/NMI
  Bottom 0.305: C19.1 70.42,58 RESET.3 arc90 71.87,59.37 74.93,59.37 arc-90 78.42,55.88 arc-90 74.93,52.39 74.61,52.39 74.61,46.99 75.56,46.04 75.56,30.48 74.61,29.53 73.76,29.53 R5.1 72.29,29.63 71.44,30.48 68.58,30.48 SV2.11 66.04,27.94 54.82,27.94 IC2.58
RW
  Bottom 0.305: IC2.18 35.09,44.13 25.72,44.13 24.13,45.72 20.64,45.72 18.16,48.2 U$2.5
SHUNT1_I
  Bottom 0.305: IC2.5 30.48,15.3 30.48,15.24
  Bottom 0.406: U2.1 21.81,16.19 C15.1 29.95,15.77 30.48,15.24 30.48,13.12 R8.2
SHUNT1_V  (via drill 0.8 pad 1.42)
  Top 0.406: v27.94,17.78 27.94,8.89 R11.3
  Bottom 0.305: IC2.6 32.25,17.78 v27.94,17.78
  Bottom 0.406: R25.1 27.52,8.47 R11.3 | C27.1 28.57,18.41 v27.94,17.78 25.42,17.78 D2.C
SHUNT2_I
  Bottom 0.305: IC2.3 40.64,24.05 40.64,21.91 42.86,19.68 46.35,16.19
  Bottom 0.406: U3.1 46.35,16.19 49.43,16.19 C26.1 57.89,16.09 60.43,13.55 R9.2
SHUNT2_V  (via drill 0.8 pad 1.42)
  Top 0.406: v43.18,17.46 49.21,17.46 53.98,12.7 53.98,8.26 R26.3
  Bottom 0.305: IC2.4 37.15,21.27 D3.C 35.32,18.07 C28.1
  Bottom 0.406: R15.1 57.78,11.64 57.78,9.21 56.2,7.62 R26.3 | 37.44,17.78 D3.C | 37.8,18.73 D3.C | v43.18,17.46 41.59,19.05 37.15,19.05 D3.C
SMCLK
  Bottom 0.305: IC2.49 55.47,33.66 55.56,33.66 55.88,33.97 55.88,36.83 58.74,39.69 61.59,39.69 62.23,40.32 JP4.3
TCK
  Bottom 0.305: SV2.7 66.04,33.02 66.04,31.11 63.5,28.57 54.89,28.57 IC2.57
TDI
  Bottom 0.305: SV2.3 64.77,36.83 64.77,31.75 62.87,29.84 55.04,29.84 IC2.55
TDO
  Bottom 0.305: IC2.54 55.11,30.48 62.55,30.48 64.14,32.07 64.14,38.73 SV2.1
TMS
  Bottom 0.305: SV2.5 65.41,34.92 65.41,31.43 63.18,29.21 54.96,29.21 IC2.56
UART1_RX
  Bottom 0.305: IC2.35 53.34,44.53 JP5.1
UART1_TX
  Bottom 0.305: IC2.34 52.07,43.97 JP5.2
USBD_N
  Bottom 0.305: R13.2 17.5,41.59 19.79,43.88 23.39,43.88 25.59,41.67 IC1.16
USBD_P
  Bottom 0.305: R14.2 18.69,43.5 19.58,44.39 23.6,44.39 25.66,42.33 IC1.15
VCC_OUT
  Bottom 0.305: SV2.4 70.23,39.75 SJ3.1
VIN
  Top 1.016: 12.38,36.83 10.89,36.83 X2.VBUS 10.79,36.77 10.79,35.24 | 12.38,36.83 13.34,37.78 13.34,42.86 14.29,43.81 D1.A | SV3.3 9.53,27.94 10.79,29.21 10.79,35.24 | 12.38,36.83 10.79,35.24
VIN+
  Bottom 0.406: U2.3 18.41,14.29 19.31,13.39 R6.1 | R25.2 25.82,10.58 R2.P$1
  Bottom 2.54: J1.2 22.07,10.16 | 22.07,10.16 R6.1 | 22.07,10.16 R2.P$1
VIN-
  Bottom 0.406: U2.4 14.61,14.29 13.71,13.39 R6.2
  Bottom 2.54: R2.P$2 9.53,10.16 | 9.53,10.16 R6.2 | J2.1 9.68,9.68 9.53,10.16
VO
  Top 0.305: U$2.3 12.38,49.97 12.38,58.74 9.84,58.74 R24.2
XIN
  Bottom 0.305: IC2.8 38.28,25.22 37.06,24.01 Q2.1 36.51,24.45 | R1.2 36.51,24.45 | C1.1 36.51,24.45
  Bottom 0.61: Q3.2 | Q3.2 38.28,25.22
XOUT
  Bottom 0.305: IC2.9 39.97,27.62 35.56,27.62 33.73,27.62 Q2.2 33.97,26.99 | 33.97,26.99 R1.1 | C2.1 33.97,26.99
  Bottom 0.61: Q3.1 35.61,27.68 35.56,27.62
XT2IN
  Bottom 0.305: IC2.53 55.18,31.11 58.61,31.11 Q1.2 R10.1 60.96,33.12 C18.1
XT2OUT
  Bottom 0.305: IC2.52 55.25,31.75 56.52,31.75 57.78,33.02 57.78,34.92 | C17.1 60.96,34.82 R10.2 57.89,34.82 57.78,34.92 | 57.78,34.92 57.78,35.12 Q1.1
(copper drawn outside any net)
  shapes: Bottom area x2

### Text on the board
tNames: Power | Vmax:50V | Vmax:50V | Current | Current | Max:30A | Max:30A
bNames: Sefa Unal | 4/2014
bDocu: +3V3 | +5V